# EAGLE design Relay_Schem (EAGLE 9.4.0)
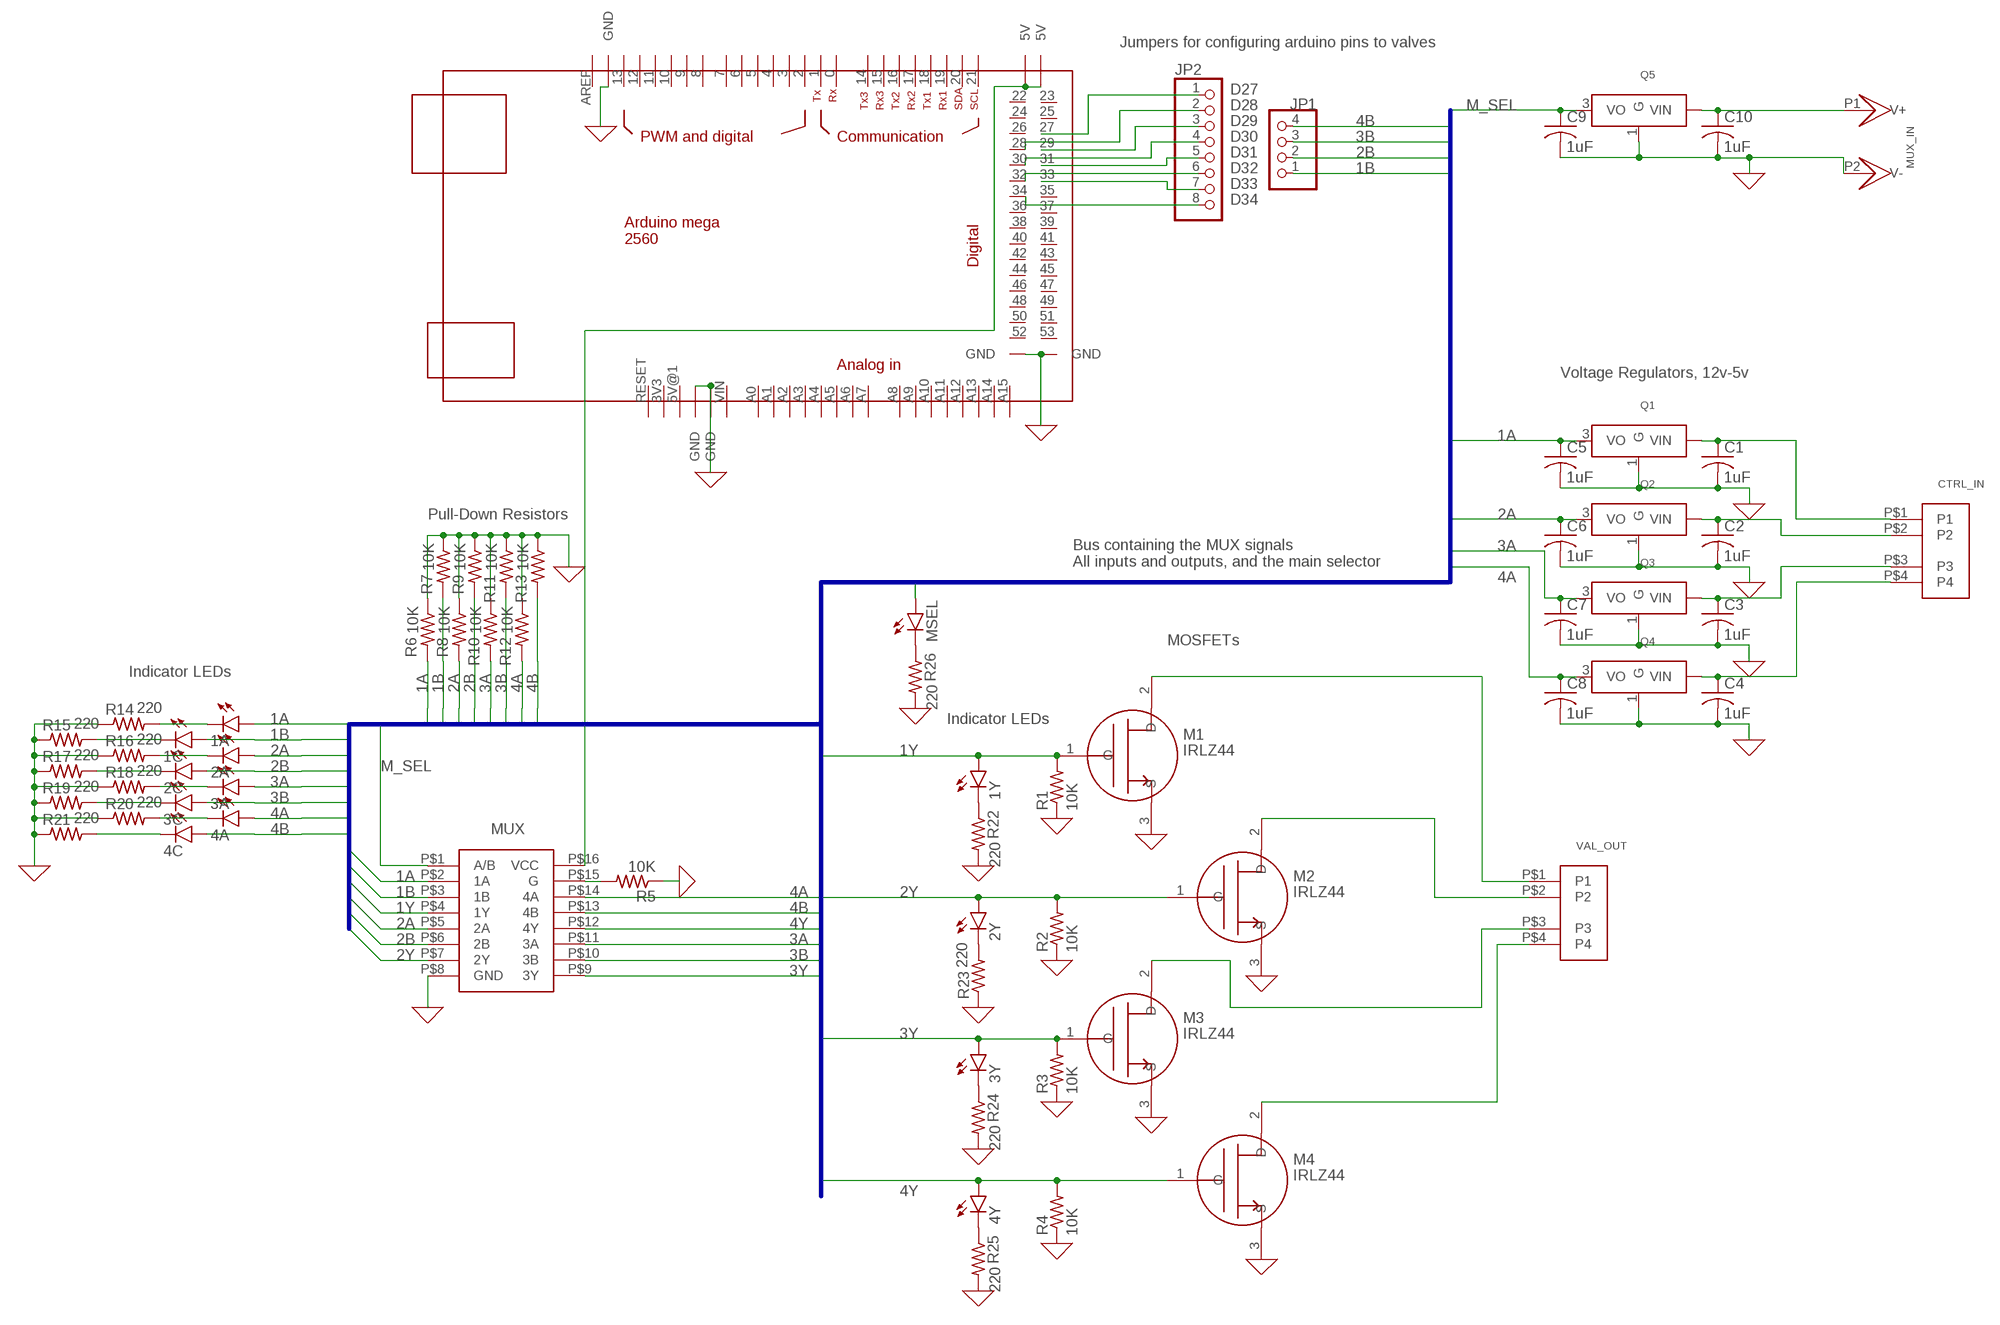
[diagram p0: schematic, sheet 1]

## Parts
1A  LED3MM  [LED3MM]
1C  LED3MM  [LED3MM]
1Y  LED3MM  [LED3MM]
2A  LED3MM  [LED3MM]
2C  LED3MM  [LED3MM]
2Y  LED3MM  [LED3MM]
3A  LED3MM  [LED3MM]
3C  LED3MM  [LED3MM]
3Y  LED3MM  [LED3MM]
4A  LED3MM  [LED3MM]
4C  LED3MM  [LED3MM]
4Y  LED3MM  [LED3MM]
C1  1uF  C-US025-024X044  [C025-024X044]
C2  1uF  C-US025-024X044  [C025-024X044]
C3  1uF  C-US025-024X044  [C025-024X044]
C4  1uF  C-US025-024X044  [C025-024X044]
C5  1uF  C-US025-024X044  [C025-024X044]
C6  1uF  C-US025-024X044  [C025-024X044]
C7  1uF  C-US025-024X044  [C025-024X044]
C8  1uF  C-US025-024X044  [C025-024X044]
C9  1uF  C-US025-024X044  [C025-024X044]
C10  1uF  C-US025-024X044  [C025-024X044]
CTRL_IN  JST_CONNECTOR  [B4B-XH-A(LF)(SN)]
JP1  PINHD-1X4  [1X04]
JP2  PINHD-1X8  [1X08]
M1  IRLZ44  FET_N  [TO220V]
M2  IRLZ44  FET_N  [TO220V]
M3  IRLZ44  FET_N  [TO220V]
M4  IRLZ44  FET_N  [TO220V]
MSEL  LED3MM  [LED3MM]
MUX  MULTIPLEXER  [SN74HC157]
MUX_IN  COAX_POW_2.1MM  [PJ-102A]
Q1  LINEAR_REGULATOR  [LINREG_FP]
Q2  LINEAR_REGULATOR  [LINREG_FP]
Q3  LINEAR_REGULATOR  [LINREG_FP]
Q4  LINEAR_REGULATOR  [LINREG_FP]
Q5  LINEAR_REGULATOR  [LINREG_FP]
R1  10K  R-US_0204/7  [0204/7]
R2  10K  R-US_0204/7  [0204/7]
R3  10K  R-US_0204/7  [0204/7]
R4  10K  R-US_0204/7  [0204/7]
R5  10K  R-US_0204/7  [0204/7]
R6  10K  R-US_0204/7  [0204/7]
R7  10K  R-US_0204/7  [0204/7]
R8  10K  R-US_0204/7  [0204/7]
R9  10K  R-US_0204/7  [0204/7]
R10  10K  R-US_0204/7  [0204/7]
R11  10K  R-US_0204/7  [0204/7]
R12  10K  R-US_0204/7  [0204/7]
R13  10K  R-US_0204/7  [0204/7]
R14  220  R-US_0204/7  [0204/7]
R15  220  R-US_0204/7  [0204/7]
R16  220  R-US_0204/7  [0204/7]
R17  220  R-US_0204/7  [0204/7]
R18  220  R-US_0204/7  [0204/7]
R19  220  R-US_0204/7  [0204/7]
R20  220  R-US_0204/7  [0204/7]
R21  220  R-US_0204/7  [0204/7]
R22  220  R-US_0204/7  [0204/7]
R23  220  R-US_0204/7  [0204/7]
R24  220  R-US_0204/7  [0204/7]
R25  220  R-US_0204/7  [0204/7]
R26  220  R-US_0204/7  [0204/7]
U$2  MEGA_DEVICE  [MEGAOUTLINE]
VAL_OUT  JST_CONNECTOR  [B4B-XH-A(LF)(SN)]

## Nets
0: C1.2 C2.2 C3.2 C4.2 C5.2 C6.2 C7.2 C8.2 C9.2 C10.2 M1.3(S) M2.3(S) M3.3(S) M4.3(S) MUX.P$8(GND) MUX_IN.P2(V-) Q1.1(G) Q2.1(G) Q3.1(G) Q4.1(G) Q5.1(G) R1.1 R2.1 R3.1 R4.1 R5.1 R6.1 R7.1 R8.1 R9.1 R10.1 R11.1 R12.1 R13.1 R14.1 R15.1 R16.1 R17.1 R18.1 R19.1 R20.1 R21.1 R22.2 R23.1 R24.2 R25.2 R26.2 U$2.GND@1(GND) U$2.GND@2(GND) U$2.GND@3(GND) U$2.GND@4(GND) U$2.GND@5(GND) ; supply symbol labelled GND
1A: 1A.A C5.1 MUX.P$2(1A) Q1.3(VO) R6.2
1B: 1C.A JP1.1 MUX.P$3(1B) R7.2
1Y: 1Y.A M1.1(G) MUX.P$4(1Y) R1.2
2A: 2A.A C6.1 MUX.P$5(2A) Q2.3(VO) R8.2
2B: 2C.A JP1.2 MUX.P$6(2B) R9.2
2Y: 2Y.A M2.1(G) MUX.P$7(2Y) R2.2
3A: 3A.A C7.1 MUX.P$11(3A) Q3.3(VO) R10.2
3B: 3C.A JP1.3 MUX.P$10(3B) R11.2
3Y: 3Y.A M3.1(G) MUX.P$9(3Y) R3.2
4A: 4A.A C8.1 MUX.P$14(4A) Q4.3(VO) R12.2
4B: 4C.A JP1.4 MUX.P$13(4B) R13.2
4Y: 4Y.A M4.1(G) MUX.P$12(4Y) R4.2
D27: JP2.1 U$2.27
D28: JP2.2 U$2.28
D29: JP2.3 U$2.29
D30: JP2.4 U$2.30
D31: JP2.5 U$2.31
D32: JP2.6 U$2.32
D33: JP2.7 U$2.33
D34: JP2.8 U$2.34
M_SEL: C9.1 MSEL.A MUX.P$1(A/B) Q5.3(VO)
N$1: C1.1 CTRL_IN.P$1(P1) Q1.2(VIN)
N$2: C2.1 CTRL_IN.P$2(P2) Q2.2(VIN)
N$3: M1.2(D) VAL_OUT.P$1(P1)
N$4: C3.1 CTRL_IN.P$3(P3) Q3.2(VIN)
N$5: M2.2(D) VAL_OUT.P$2(P2)
N$6: MUX.P$16(VCC) U$2.5V@2(5V) U$2.5V@3(5V)
N$7: MSEL.K(C) R26.1
N$8: M3.2(D) VAL_OUT.P$3(P3)
N$9: M4.2(D) VAL_OUT.P$4(P4)
N$10: MUX.P$15(G) R5.2
N$11: 1Y.K(C) R22.1
N$12: C4.1 CTRL_IN.P$4(P4) Q4.2(VIN)
N$13: 4A.K(C) R20.2
N$14: 3A.K(C) R18.2
N$15: 2A.K(C) R16.2
N$16: 1A.K(C) R14.2
N$17: 1C.K(C) R15.2
N$18: 2C.K(C) R17.2
N$19: 3C.K(C) R19.2
N$20: 4C.K(C) R21.2
N$21: 2Y.K(C) R23.2
N$22: 3Y.K(C) R24.1
N$23: 4Y.K(C) R25.1
N$24: C10.1 MUX_IN.P1(V+) Q5.2(VIN)
Unconnected: U$2.0 U$2.1 U$2.2 U$2.3 U$2.3V3 U$2.4 U$2.5 U$2.5V@1(5V) U$2.6 U$2.7 U$2.8 U$2.9 U$2.10 U$2.11 U$2.12 U$2.13 U$2.14 U$2.15 U$2.16 U$2.17 U$2.18 U$2.19 U$2.20 U$2.21 U$2.22 U$2.23 U$2.24 U$2.25 U$2.26 U$2.35 U$2.36 U$2.37 U$2.38 U$2.39 U$2.40 U$2.41 U$2.42 U$2.43 U$2.44 U$2.45 U$2.46 U$2.47 U$2.48 U$2.49 U$2.50 U$2.51 U$2.52 U$2.53 U$2.A0 U$2.A1 U$2.A2 U$2.A3 U$2.A4 U$2.A5 U$2.A6 U$2.A7 U$2.A8 U$2.A9 U$2.A10 U$2.A11 U$2.A12 U$2.A13 U$2.A14 U$2.A15 U$2.AREF U$2.RESET U$2.VIN

## Buses
1A,1B,1Y,2A,2B,2Y,3A,3B,3Y,4A,4B,4Y,M_SEL

## Notes on the sheet
- Jumpers for configuring arduino pins to valves
- Voltage Regulators, 12v-5v
- Pull-Down Resistors
- Bus containing the MUX signals
  All inputs and outputs, and the main selector
- MOSFETs
- Indicator LEDs
- Indicator LEDs

## Library data of the parts
1A 1C 1Y 2A 2C 2Y 3A 3C 3Y 4A 4C 4Y MSEL = led:LED: LED OSRAM: - CHIPLED LG R971, LG N971, LY N971, LG Q971, LY Q971, LO R971, LY R971 LH N974, LH R974 LS Q976, LO Q976, LY Q976 LO Q996 - Hyper CHIPLED LW Q18S LB Q993, LB Q99A, LB R99A - SideLED LS A670, LO A670, LY A670, LG A670, LP A670 LB A673, LV A673, LT A673, LW A673 LH A674 LY A675 LS A676, LA A676, LO A676, LY A676, LW A676 LS A679, LY A679, LG A679 - Hyper Micro SIDELED® LS Y876, LA Y876, LO Y876, LY Y876 LT Y87S - SmartLED LW L88C, LW L88S LB L89C, LB L89S, LG L890 LS L89K, LO L89K, LY L89K LS L896, LA L896, LO L896, LY L896 - TOPLED LS T670, LO T670, LY T670, LG T670, LP T670 LSG T670, LSP T670, LSY T670, LOP T670, LYG T670 LG T671, LOG T671, LSG T671 LB T673, LV T673, LT T673, LW T673 LH T674 LS T676, LA T676, LO T676, LY T676, LB T676, LH T676, LSB T676, LW T676 LB T67C, LV T67C, LT T67C, LS T67K, LO T67K, LY T67K, LW E67C LS E67B, LA E67B, LO E67B, LY E67B, LB E67C, LV E67C, LT E67C LW T67C LS T679, LY T679, LG T679 LS T770, LO T770, LY T770, LG T770, LP T770 LB T773, LV T773, LT T773, LW T773 LH T774 LS E675, LA E675, LY E675, LS T675 LS T776, LA T776, LO T776, LY T776, LB T776 LHGB T686 LT T68C, LB T68C - Hyper Mini TOPLED® LB M676 - Mini TOPLED Santana® LG M470 LS M47K, LO M47K, LY M47K Source: http://www.osram.convergy.de LUXEON: - LUMILED® LXK2-PW12-R00, LXK2-PW12-S00, LXK2-PW14-U00, LXK2-PW14-V00 LXK2-PM12-R00, LXK2-PM12-S00, LXK2-PM14-U00 LXK2-PE12-Q00, LXK2-PE12-R00, LXK2-PE12-S00, LXK2-PE14-T00, LXK2-PE14-U00 LXK2-PB12-K00, LXK2-PB12-L00, LXK2-PB12-M00, LXK2-PB14-N00, LXK2-PB14-P00, LXK2-PB14-Q00 LXK2-PR12-L00, LXK2-PR12-M00, LXK2-PR14-Q00, LXK2-PR14-R00 LXK2-PD12-Q00, LXK2-PD12-R00, LXK2-PD12-S00 LXK2-PH12-R00, LXK2-PH12-S00 LXK2-PL12-P00, LXK2-PL12-Q00, LXK2-PL12-R00 Source: www.luxeon.com KINGBRIGHT: KA-3528ASYC Source: www.kingbright.com
C1-C10 = rcl:C-US: CAPACITOR, American symbol; SPICEPREFIX: C
CTRL_IN VAL_OUT = LPRD_RELAY:JST_CONNECTOR
JP1 = pinhead:PINHD-1X4: PIN HEADER
JP2 = pinhead:PINHD-1X8: PIN HEADER
M1-M4 = LPRD_RELAY:FET_N: N-Type MOS Field Effect Transistor (MOSFET)
MUX = LPRD_RELAY:MULTIPLEXER: Quadruple 2-line to 1-line data selector SN54HC157: https://www.digikey.com/product-detail/en/texas-instruments/SN74HC157N/296-1578-5-ND/277224
MUX_IN = LPRD_RELAY:COAX_POW_2.1MM: Coax Power, Center Power PJ-102A: https://www.digikey.com/product-detail/en/cui-inc/PJ-102A/CP-102A-ND/275425
Q1-Q5 = LPRD_RELAY:LINEAR_REGULATOR
R1-R26 = rcl:R-US_: RESISTOR, American symbol; SPICEPREFIX: R
U$2 = ArduinoMegaOutline:MEGA_DEVICE: mega card as device

## Board
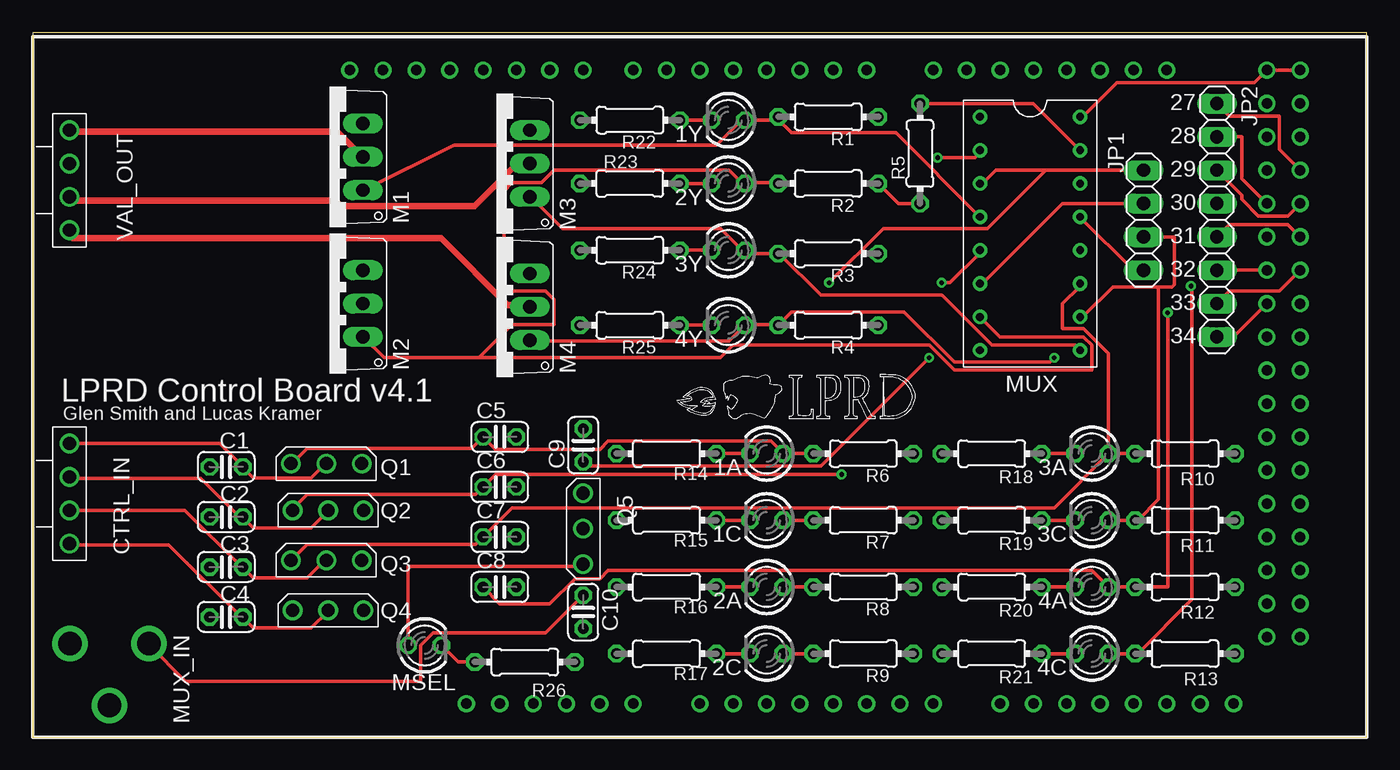
[diagram p1: board, top side]
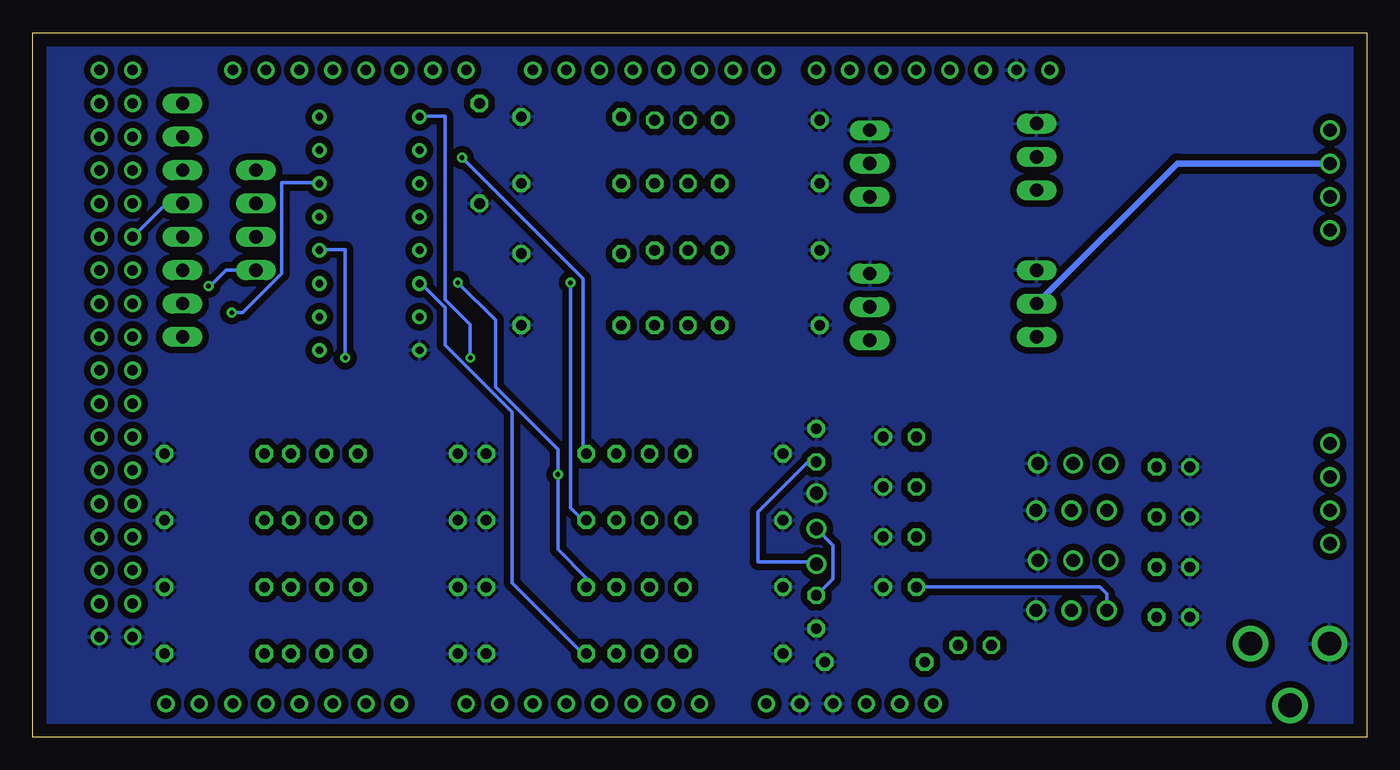
[diagram p2: board, bottom side, seen from below]

Size 101.58 x 53.65 mm. Coordinates in mm from the lower left corner, seen from the top.
Outline: 0,0 101.58,0 101.58,53.65 0,53.65 0,0
Copper layers (1*16): Top 0.035mm / dielectric 1.5mm / Bottom 0.035mm
Design rules "default *": minimum track width 10mil, minimum drill 0.35mm, track to track 6mil, track to pad 6mil, pad to pad 6mil, via to via 6mil, smd to smd 6mil, copper to edge 40mil, drill to drill 6mil, minimum pad ring 10mil, minimum via ring 8mil, stop-mask expansion 4mil, vias tented up to drill 0mil, thermal gap 10mil

### Footprints (pad centres in the part's own frame; a part is rotated, then mirrored left to right if it is on the bottom)
LED3MM = drill 0.813 octagon: A -1.27,0; K 1.27,0
C025-024X044 = drill 0.813 octagon: 1 -1.27,0; 2 1.27,0
B4B-XH-A(LF)(SN) = drill 1: P$1 -5.08,0; P$2 -2.54,0; P$3 0,0; P$4 2.54,0
1X04 = drill 1.016 long: 1 -3.81,0; 2 -1.27,0; 3 1.27,0; 4 3.81,0
1X08 = drill 1.016 long: 1 -8.89,0; 2 -6.35,0; 3 -3.81,0; 4 -1.27,0; 5 1.27,0; 6 3.81,0; 7 6.35,0; 8 8.89,0
TO220V = drill 1.016 long: 1 -2.54,-2.54; 2 0,-2.54; 3 2.54,-2.54
SN74HC157 = drill 0.6: P$1 -8.89,-3.81; P$2 -6.35,-3.81; P$3 -3.81,-3.81; P$4 -1.27,-3.81; P$5 1.27,-3.81; P$6 3.81,-3.81; P$7 6.35,-3.81; P$8 8.89,-3.81; P$9 8.89,3.81; P$10 6.35,3.81; P$11 3.81,3.81; P$12 1.27,3.81; P$13 -1.27,3.81; P$14 -3.81,3.81; P$15 -6.35,3.81; P$16 -8.89,3.81
PJ-102A = drill 1.8: P1 0,-3; P2 0,3; P3 -4.7,0
LINREG_FP = drill 1: 1 -2.7,0; 2 0,0; 3 2.7,0
0204/7 = drill 0.813 octagon: 1 -3.81,0; 2 3.81,0
MEGAOUTLINE = drill 0.8: 0 12.7,24.13; 1 10.16,24.13; 2 7.62,24.13; 3 5.08,24.13; 3V3 -15.24,-24.13; 4 2.54,24.13; 5 0,24.13; 5V@1 -12.7,-24.13; 5V@2 43.18,24.13; 5V@3 45.72,24.13; 6 -2.54,24.13; 7 -5.08,24.13; 8 -8.89,24.13; 9 -11.43,24.13; 10 -13.97,24.13; 11 -16.51,24.13; 12 -19.05,24.13; 13 -21.59,24.13; 14 17.78,24.13; 15 20.32,24.13; 16 22.86,24.13; 17 25.4,24.13; 18 27.94,24.13; 19 30.48,24.13; 20 33.02,24.13; 21 35.56,24.13; 22 43.18,21.59; 23 45.72,21.59; 24 43.18,19.05; 25 45.72,19.05; 26 43.18,16.51; 27 45.72,16.51; 28 43.18,13.97; 29 45.72,13.97; 30 43.18,11.43; 31 45.72,11.43; 32 43.18,8.89; 33 45.72,8.89; 34 43.18,6.35; 35 45.72,6.35; 36 43.18,3.81; 37 45.72,3.81; 38 43.18,1.27; 39 45.72,1.27; 40 43.18,-1.27; 41 45.72,-1.27; 42 43.18,-3.81; 43 45.72,-3.81; 44 43.18,-6.35; 45 45.72,-6.35; 46 43.18,-8.89; 47 45.72,-8.89; 48 43.18,-11.43; 49 45.72,-11.43; 50 43.18,-13.97; 51 45.72,-13.97; 52 43.18,-16.51; 53 45.72,-16.51; A0 0,-24.13; A1 2.54,-24.13; A2 5.08,-24.13; A3 7.62,-24.13; A4 10.16,-24.13; A5 12.7,-24.13; A6 15.24,-24.13; A7 17.78,-24.13; A8 22.86,-24.13; A9 25.4,-24.13; A10 27.94,-24.13; A11 30.48,-24.13; A12 33.02,-24.13; A13 35.56,-24.13; A14 38.1,-24.13; A15 40.64,-24.13; AREF -26.67,24.13; GND@1 -24.13,24.13; GND@2 -10.16,-24.13; GND@3 -7.62,-24.13; GND@4 43.18,-19.05; GND@5 45.72,-19.05; RESET -17.78,-24.13; VIN -5.08,-24.13

### Placement (x,y rotation side)
1A  55.88,21.59 180 top
1C  55.88,16.51 180 top
1Y  52.96,46.99 180 top
2A  55.88,11.43 180 top
2C  55.88,6.35 180 top
2Y  52.96,42.16 180 top
3A  80.64,21.59 180 top
3C  80.64,16.51 180 top
3Y  52.96,37.08 180 top
4A  80.64,11.43 180 top
4C  80.64,6.35 180 top
4Y  52.96,31.37 180 top
C1  14.73,20.57 180 top
C2  14.73,16.76 180 top
C3  14.73,12.95 180 top
C4  14.73,9.14 180 top
C5  35.56,22.86 0 top
C6  35.56,19.05 0 top
C7  35.56,15.24 0 top
C8  35.56,11.43 0 top
C9  41.91,22.23 90 top
C10  41.91,9.53 270 top
CTRL_IN  2.79,17.27 270 top
JP1  84.58,39.37 270 top
JP2  90.17,39.37 270 top
M1  22.61,44.2 90 top
M2  22.61,33.02 90 top
M3  35.31,43.69 90 top
M4  35.31,32.77 90 top
MSEL  29.84,6.99 0 top
MUX  75.95,38.35 270 top
MUX_IN  5.84,7.11 90 top
Q1  22.35,20.83 180 top
Q2  22.48,17.27 180 top
Q3  22.35,13.46 180 top
Q4  22.48,9.65 180 top
Q5  41.91,15.88 270 top
R1  60.58,47.24 180 top
R2  60.58,42.16 180 top
R3  60.58,36.83 180 top
R4  60.58,31.37 180 top
R5  67.56,44.45 90 top
R6  63.25,21.59 180 top
R7  63.25,16.51 180 top
R8  63.25,11.43 180 top
R9  63.25,6.35 180 top
R10  87.76,21.59 180 top
R11  87.76,16.51 180 top
R12  87.76,11.43 180 top
R13  87.76,6.35 180 top
R14  48.26,21.59 0 top
R15  48.26,16.51 0 top
R16  48.26,11.43 0 top
R17  48.26,6.35 0 top
R18  73.03,21.59 0 top
R19  73.03,16.51 0 top
R20  73.03,11.43 0 top
R21  73.03,6.35 0 top
R22  45.47,46.99 180 top
R23  45.47,42.16 0 top
R24  45.47,37.08 180 top
R25  45.47,31.37 180 top
R26  37.47,5.71 0 top
U$2  50.8,26.67 0 top
VAL_OUT  2.79,41.15 270 top

### Tracks (layer width: path | path; a pad name or v marks a point on that pad's centre or on a via)
0
  Top 0.254: R5.1 65.91,40.64 R2.1
  Bottom 0.254: 67.82,40.64 R5.1
  pour Bottom (isolate 0.5): 0.64,52.7 0.64,0.64 100.97,0.64 100.97,52.7
1A  (via drill 0.35)
  Top 0.254: Q1.3 19.94,21.02 20.89,21.97 33.4,21.97 C5.1 35.24,21.91 43.18,21.91 43.81,22.54 56.2,22.54 1A.A R6.2 | v68.9,44.13 71.75,44.13 72.07,44.45 MUX.P$2
  Bottom 0.254: v68.9,44.13 59.69,34.92 59.69,21.59 R6.2
1B  (via drill 0.35)
  Top 0.254: R7.2 1C.A | JP1.1 77.15,43.18 | 77.15,43.18 73.34,43.18 72.39,42.23 MUX.P$3 | v60.64,34.61 64.77,38.73 72.71,38.73 77.15,43.18
  Bottom 0.254: v60.64,34.61 60.64,17.46 59.69,16.51 R7.2
1Y
  Top 0.254: MUX.P$4 65.72,46.04 57.78,46.04 56.83,46.99 R1.2 56.52,46.99 1Y.A 53.98,46.99 52.07,45.09 32.07,45.09 25.21,41.66 M1.1
2A  (via drill 0.35)
  Top 0.254: Q2.3 19.94,17.53 20.89,18.48 33.72,18.48 C6.1 35.24,20 v61.59,20 | v69.22,34.61 69.85,34.61 72.07,36.83 MUX.P$5 | R8.2 2A.A
  Bottom 0.254: v69.22,34.61 66.36,31.75 66.36,26.67 61.59,21.91 v61.59,20 61.59,14.29 59.37,12.06 59.37,11.43 R8.2
2B
  Top 0.254: R9.2 2C.A | JP1.2 78.42,40.64 72.39,34.61 MUX.P$6
  Bottom 0.254: R9.2 59.69,6.35 65.09,11.75 65.09,24.77 70.17,29.84 70.17,32.7 72.07,34.61 MUX.P$6
2Y
  Top 0.254: R2.2 56.52,42.23 54.29,42.23 2Y.A 53.98,42.23 53.02,43.18 39.69,43.18 38.73,42.23 36.51,42.23 35.88,41.59 35.88,33.97 39.05,33.97 39.69,33.34 39.69,31.43 36.51,31.43 33.97,28.89 | MUX.P$7 73.66,30.48 80.01,30.48 80.64,29.84 80.64,27.94 70.17,27.94 68.26,29.84 53.34,29.84 52.39,28.89 33.97,28.89 | 33.97,28.89 26.73,28.89 M2.1
3A
  Top 0.254: 3A.A 81.92,29.21 80.01,31.11 78.42,31.11 78.42,33.02 79.69,34.29 MUX.P$11 | 3A.A R10.2 | Q3.3 19.94,13.72 20.89,14.67 33.72,14.67 C7.1 36.51,17.46 77.79,17.46 3A.A
3B
  Top 0.254: 3C.A R11.2 84.14,16.51 85.72,18.1 85.72,34.29 | 85.72,34.29 86.74,34.29 86.93,34.48 86.93,38.1 JP1.3 | 85.72,34.29 82.23,34.29 80.01,32.07 MUX.P$10
3Y
  Top 0.254: MUX.P$9 79.38,29.84 73.03,29.84 69.22,33.66 60.01,33.66 56.83,36.83 R3.2 54.29,36.83 3Y.A 53.98,37.15 52.39,38.73 40.32,38.73 38.1,40.96 M3.1
4A  (via drill 0.35)
  Top 0.254: v86.42,32.32 86.42,11.43 R12.2 4A.A 80.64,12.7 43.81,12.7 43.18,12.06 41.27,12.06 39.37,10.16 35.56,10.16 C8.1
  Bottom 0.254: MUX.P$14 80.01,42.23 82.61,42.23 82.61,35.29 85.59,32.32 v86.42,32.32 | C8.1 20.32,11.43 19.78,10.89 Q4.3
4B  (via drill 0.35)
  Top 0.254: 4C.A R13.2 84.14,6.35 88.27,10.48 88.27,34.35 v88.2,34.35 | MUX.P$13 83.82,35.56 JP1.4
  Bottom 0.254: v88.2,34.35 88.08,34.35 86.87,35.56 JP1.4
4Y  (via drill 0.35)
  Top 0.254: v77.79,28.89 77.47,28.57 70.17,28.57 66.36,32.38 57.78,32.38 R4.2 56.52,31.43 54.29,31.43 4Y.A 53.02,30.16 38.1,30.16 M4.1
  Bottom 0.254: v77.79,28.89 77.79,37.15 79.69,37.15 MUX.P$12
D27
  Top 0.254: U$2.27 94.93,44.77 94.93,47.31 91.12,47.31 JP2.1
D28
  Top 0.254: U$2.28 92.08,42.55 92.08,45.72 JP2.2
D29
  Top 0.254: U$2.29 95.57,39.69 93.34,39.69 92.08,40.96 92.08,41.27 JP2.3
D30
  Bottom 0.254: U$2.30 91.44,40.64 JP2.4
D31
  Top 0.254: U$2.31 95.57,39.05 91.12,39.05 JP2.5
D32
  Top 0.254: JP2.6 U$2.32
D33
  Top 0.254: U$2.33 94.93,33.97 91.12,33.97 JP2.7
D34
  Top 0.254: U$2.34 91.44,30.48 JP2.8
M_SEL  (via drill 0.35)
  Top 0.254: MSEL.A 28.57,13.02 41.91,13.02 Q5.3 | v68.26,28.89 60.01,20.64 42.23,20.64 C9.1
  Bottom 0.254: v68.26,28.89 68.26,31.43 70.17,33.34 70.17,47.31 72.07,47.31 MUX.P$1 | C9.1 42.55,20.95 46.35,17.14 46.35,13.34 41.91,13.34 Q5.3
N$1
  Top 0.254: Q1.2 22.16,20.7 21.21,19.75 16.76,19.75 16.13,20.38 C1.1 14.22,22.35 CTRL_IN.P$1
N$2
  Top 0.254: Q2.2 22.48,17.21 21.21,15.94 16.76,15.94 16.13,16.57 C2.1 15.85,16.66 12.8,19.71 2.85,19.71 CTRL_IN.P$2
N$3
  Top 0.254: 2.85,46.13 VAL_OUT.P$1 | 24.99,44.3 M1.2
  Top 0.508: 2.85,46.13 23.16,46.13 24.99,44.3
N$4
  Top 0.254: Q3.2 22.16,13.4 20.89,12.13 16.76,12.13 16.13,12.76 C3.1 15.85,13.01 11.58,17.27 CTRL_IN.P$3
N$5
  Bottom 0.254: 24.99,33.12 M2.2
  Bottom 0.508: VAL_OUT.P$2 14.43,43.69 24.99,33.12
N$6
  Top 0.254: MUX.P$16 80.01,47.31 82.55,49.85 93.03,49.85 U$2.5V@2 U$2.5V@3
N$7
  Top 0.254: R26.1 32.38,5.71 MSEL.K
N$8
  Top 0.508: M3.2 36.88,43.69 33.63,40.44 23.47,40.44 23.06,40.84 2.85,40.84 VAL_OUT.P$3
N$9
  Top 0.254: 37.8,32.92 M4.2
  Top 0.508: 37.8,32.92 36.17,32.92 31.09,38 3.05,38 VAL_OUT.P$4
N$10
  Top 0.254: MUX.P$15 76.2,48.26 R5.2
N$11
  Top 0.254: 1Y.K R22.1
N$12
  Top 0.254: Q4.2 22.48,9.59 21.21,8.32 16.76,8.32 16.13,8.95 C4.1 15.85,9.14 10.36,14.63 2.85,14.63 CTRL_IN.P$4
N$13
  Top 0.254: 4A.K R20.2
N$14
  Top 0.254: 3A.K R18.2
N$15
  Top 0.254: 2A.K R16.2
N$16
  Top 0.254: 1A.K R14.2
N$17
  Top 0.254: 1C.K R15.2
N$18
  Top 0.254: 2C.K R17.2
N$19
  Top 0.254: 3C.K R19.2
N$20
  Top 0.254: 4C.K R21.2
N$21
  Top 0.254: 2Y.K R23.2
N$22
  Top 0.254: 3Y.K R24.1
N$23
  Top 0.254: 4Y.K R25.1
N$24
  Top 0.254: C10.1 39.05,7.94 30.48,7.94 29.53,6.99 29.53,4.25 11.62,4.25 8.89,6.99 MUX_IN.P1
  Bottom 0.254: Q5.2 40.64,14.61 40.64,12.06 C10.1

### Text on the board
tPlace: 27 | 28 | 29 | 30 | 31 | 32 | 33 | 34 | LPRD Control Board v4.1 | Glen Smith and Lucas Kramer